# Altium schematic sheet Trackpad.SchDoc
size Letter; CompanyName: Ploopy Corporation; Organization: Ploopy Corporation; Address1: 137-1140 Burnhamthorpe Road W; Address2: Mississauga; Address3: Ontario; Address4: Canada L5C 0A3; DocumentNumber: 1; Revision: R2.002; SheetNumber: 1; SheetTotal: 8
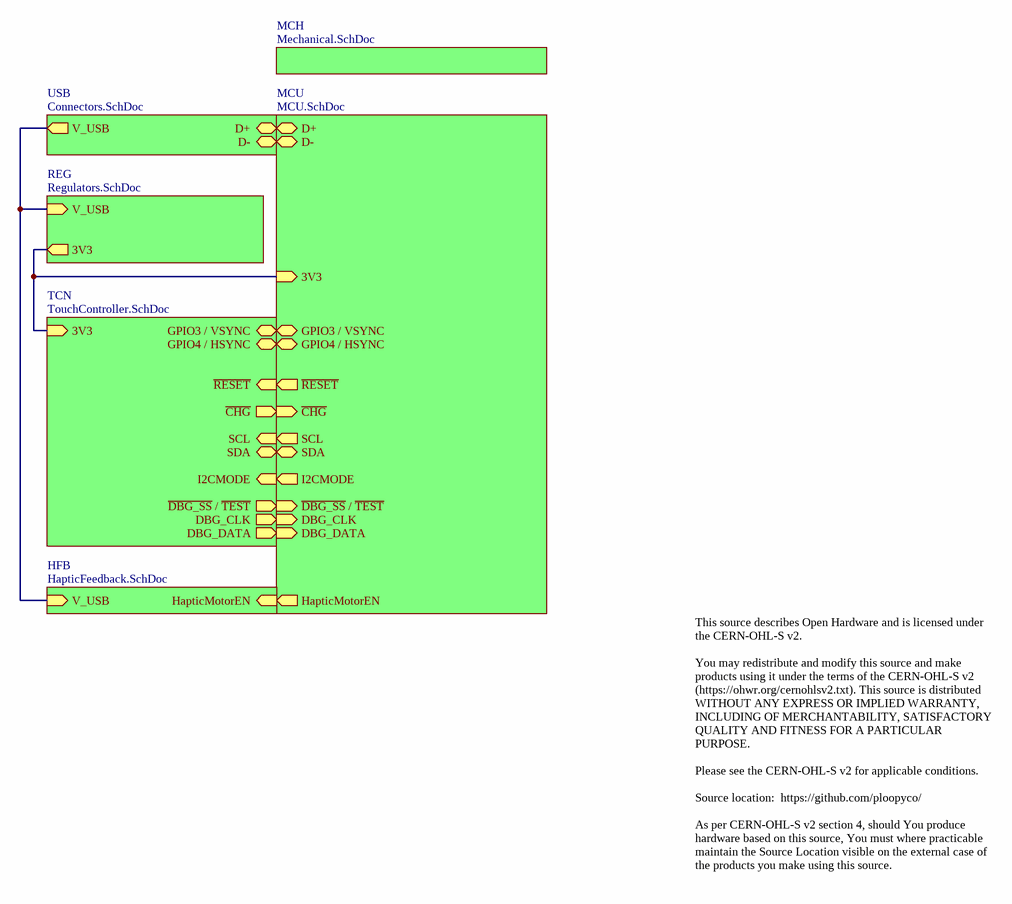
[diagram p0: Trackpad.SchDoc]

## Sub-sheets
HFB = HapticFeedback.SchDoc: HapticMotorEN (in), V_USB (in)
MCH = Mechanical.SchDoc: no entries
MCU = MCU.SchDoc: D+ (bidir), D- (bidir), 3V3 (in), GPIO4 / HSYNC (bidir), GPIO3 / VSYNC (bidir), ~{RESET} (out), ~{CHG} (in), SCL (out), SDA (bidir), DBG_DATA (in), ~{DBG_SS} / ~{TEST} (in), DBG_CLK (in), I2CMODE (out), HapticMotorEN (out)
REG = Regulators.SchDoc: 3V3 (out), V_USB (in)
TCN = TouchController.SchDoc: 3V3 (in), DBG_DATA (out), GPIO4 / HSYNC (bidir), ~{RESET} (in), ~{DBG_SS} / ~{TEST} (out), DBG_CLK (out), GPIO3 / VSYNC (bidir), ~{CHG} (out), SCL (in), SDA (bidir), I2CMODE (in)
USB = Connectors.SchDoc: D+ (bidir), V_USB (out), D- (bidir)

## Nets
(unnamed): sheet USB/D+, sheet MCU/D+
(unnamed): sheet USB/V_USB, sheet REG/V_USB, sheet HFB/V_USB
(unnamed): sheet USB/D-, sheet MCU/D-
(unnamed): sheet REG/3V3, sheet TCN/3V3, sheet MCU/3V3
(unnamed): sheet TCN/DBG_DATA, sheet MCU/DBG_DATA
(unnamed): sheet TCN/GPIO4 / HSYNC, sheet MCU/GPIO4 / HSYNC
(unnamed): sheet TCN/~{RESET}, sheet MCU/~{RESET}
(unnamed): sheet TCN/~{DBG_SS} / ~{TEST}, sheet MCU/~{DBG_SS} / ~{TEST}
(unnamed): sheet TCN/DBG_CLK, sheet MCU/DBG_CLK
(unnamed): sheet TCN/GPIO3 / VSYNC, sheet MCU/GPIO3 / VSYNC
(unnamed): sheet TCN/~{CHG}, sheet MCU/~{CHG}
(unnamed): sheet TCN/SCL, sheet MCU/SCL
(unnamed): sheet TCN/SDA, sheet MCU/SDA
(unnamed): sheet TCN/I2CMODE, sheet MCU/I2CMODE
(unnamed): sheet MCU/HapticMotorEN, sheet HFB/HapticMotorEN

## Notes on the sheet
- This source describes Open Hardware and is licensed under the CERN-OHL-S v2.
  You may redistribute and modify this source and make products using it under the terms of the CERN-OHL-S v2 (https://ohwr.org/cernohlsv2.txt). This source is distributed WITHOUT ANY EXPRESS OR IMPLIED WARRANTY, INCLUDING OF MERCHANTABILITY, SATISFACTORY QUALITY AND FITNESS FOR A PARTICULAR PURPOSE.
  Please see the CERN-OHL-S v2 for applicable conditions.
  Source location:  https://github.com/ploopyco/
  As per CERN-OHL-S v2 section 4, should You produce hardware based on this source, You must where practicable maintain the Source Location visible on the external case of the products you make using this source.
- Copyright Ploopy Corporation 2024
- Licensed under the CERN-OHL-S v2
- http://ohwr.org/cernohl
- Title:
- PCB:
- Version:
- Ploopy Corporation
- Mississauga ON L5C 0A3
- 137-1140 Burnhamthorpe Road W
- Date:
- Time:
- Sheet
- of
- Canada